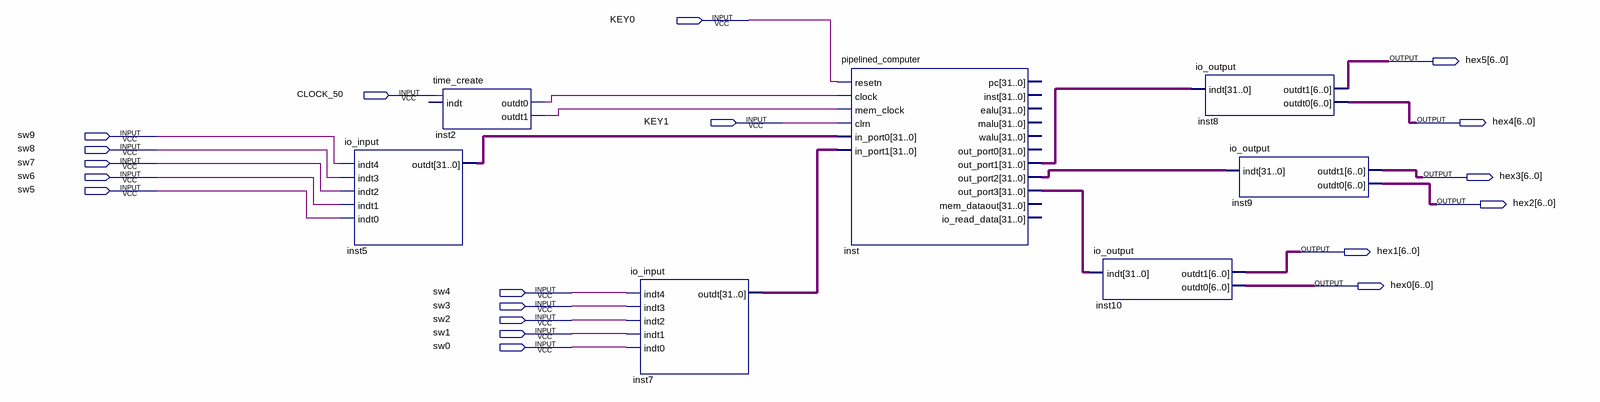
[diagram p0: schematic sheet]
// Quartus schematic pipelinecpuio.bdf as structural Verilog: 7 symbols, 19 pins
module pipelinecpuio (
  input  KEY0,
  input  CLOCK_50,
  input  KEY1,
  input  sw9,
  input  sw8,
  input  sw7,
  input  sw6,
  input  sw5,
  input  sw4,
  input  sw3,
  input  sw2,
  input  sw1,
  input  sw0,
  output [6:0] hex5,
  output [6:0] hex4,
  output [6:0] hex3,
  output [6:0] hex2,
  output [6:0] hex1,
  output [6:0] hex0
);

  wire inst2_outdt0, inst2_outdt1;
  wire [31:0] inst5_outdt, inst7_outdt, inst_out_port1, inst_out_port2, inst_out_port3;

  io_input inst5 (.indt4(sw9), .indt3(sw8), .indt2(sw7), .indt1(sw6), .indt0(sw5), .outdt(inst5_outdt));
  time_create inst2 (.indt(CLOCK_50), .outdt0(inst2_outdt0), .outdt1(inst2_outdt1));
  io_input inst7 (.indt4(sw4), .indt3(sw3), .indt2(sw2), .indt1(sw1), .indt0(sw0), .outdt(inst7_outdt));
  pipelined_computer inst (
    .resetn(KEY0), .clock(inst2_outdt0), .mem_clock(inst2_outdt1), .clrn(KEY1), .in_port0(inst5_outdt),
    .in_port1(inst7_outdt), .out_port1(inst_out_port1), .out_port2(inst_out_port2), .out_port3(inst_out_port3));  // open: pc, inst, ealu, malu, walu, out_port0, mem_dataout, io_read_data
  io_output inst10 (.indt(inst_out_port3), .outdt1(hex1), .outdt0(hex0));
  io_output inst8 (.indt(inst_out_port1), .outdt1(hex5), .outdt0(hex4));
  io_output inst9 (.indt(inst_out_port2), .outdt1(hex3), .outdt0(hex2));
endmodule
